# EAGLE design forest21 (EAGLE 7.5.0)
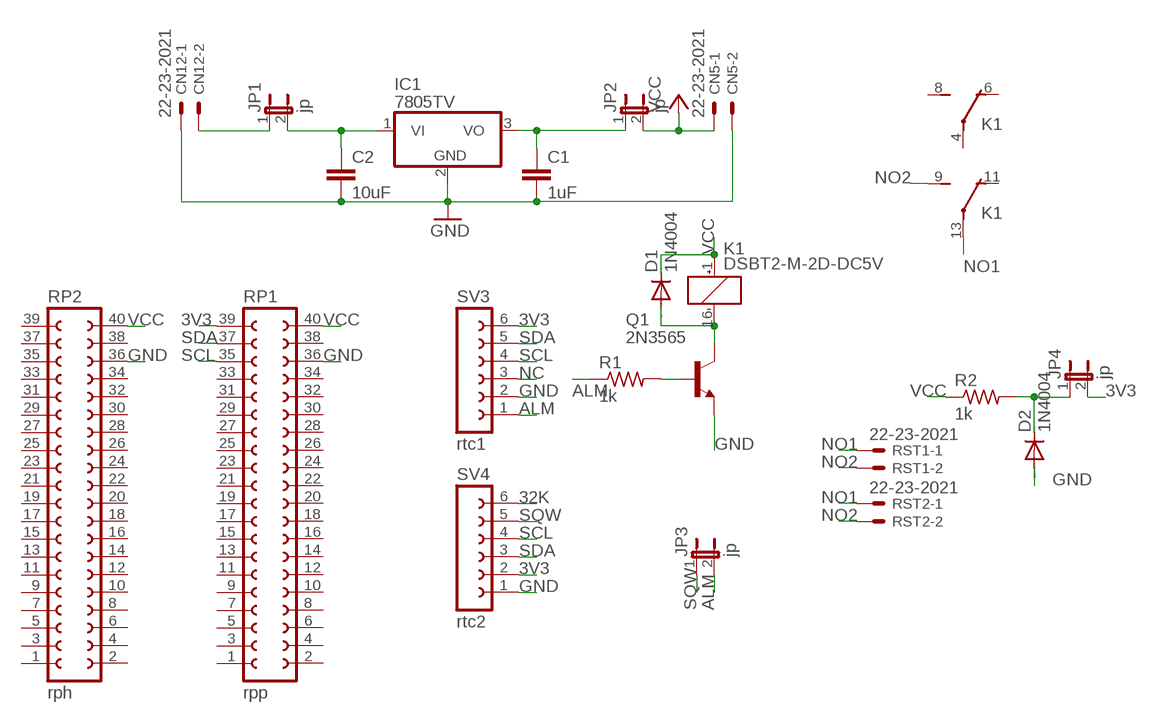
[diagram p0: schematic, sheet 1]

## Parts
C1  1uF  C-EU025-030X050  [C025-030X050]
C2  10uF  C-EU025-030X050  [C025-030X050]
CN5  22-23-2021  [22-23-2021]
CN12  22-23-2021  [22-23-2021]
D1  1N4004  [DO41-10]
D2  1N4004  [DO41-10]
IC1  7805TV  [TO220V]
JP1  jp  JP1E  [JP1]
JP2  jp  JP1E  [JP1]
JP3  jp  JP1E  [JP1]
JP4  jp  JP1E  [JP1]
K1  DSBT2-M-2D-DC5V  [DS-BT]
Q1  2N3565  [TO92]
R1  1k  R-US_0207/7  [0207/7]
R2  1k  R-US_0207/7  [0207/7]
RP1  rpp  FE20-2  [FE20-2]
RP2  rph  FE20-2  [FE20-2]
RST1  22-23-2021  [22-23-2021]
RST2  22-23-2021  [22-23-2021]
SV3  rtc1  FE06-1  [FE06]
SV4  rtc2  FE06-1  [FE06]

## Nets
3V3: JP4.2 RP1.39 SV3.6 SV4.2
32K: SV4.6
ALM: JP3.2 R1.1 SV3.1
GND: C1.2 C2.2 CN5.2 CN12.1 D2.A IC1.2(GND) Q1.3(E) RP1.36 RP2.36 SV3.2 SV4.1
N$1: CN12.2 JP1.1
N$2: C2.1 IC1.1(VI) JP1.2
N$4: C1.1 IC1.3(VO) JP2.1
N$19: Q1.2(B) R1.2
N$20: D1.A K1.16(1:-) Q1.1(C)
N$25: D2.C JP4.1 R2.2
NC: SV3.3
NO1: K1.13(3:P) RST1.1 RST2.1
NO2: K1.9(3:S) RST1.2 RST2.2
SCL: RP1.35 SV3.4 SV4.4
SDA: RP1.37 SV3.5 SV4.3
SQW: JP3.1 SV4.5
VCC: CN5.1 D1.C JP2.2 K1.1(1:+) R2.1 RP1.40 RP2.40
Unconnected: K1.4(2:P) K1.6(2:O) K1.8(2:S) K1.11(3:O) RP1.1 RP1.2 RP1.3 RP1.4 RP1.5 RP1.6 RP1.7 RP1.8 RP1.9 RP1.10 RP1.11 RP1.12 RP1.13 RP1.14 RP1.15 RP1.16 RP1.17 RP1.18 RP1.19 RP1.20 RP1.21 RP1.22 RP1.23 RP1.24 RP1.25 RP1.26 RP1.27 RP1.28 RP1.29 RP1.30 RP1.31 RP1.32 RP1.33 RP1.34 RP1.38 RP2.1 RP2.2 RP2.3 RP2.4 RP2.5 RP2.6 RP2.7 RP2.8 RP2.9 RP2.10 RP2.11 RP2.12 RP2.13 RP2.14 RP2.15 RP2.16 RP2.17 RP2.18 RP2.19 RP2.20 RP2.21 RP2.22 RP2.23 RP2.24 RP2.25 RP2.26 RP2.27 RP2.28 RP2.29 RP2.30 RP2.31 RP2.32 RP2.33 RP2.34 RP2.35 RP2.37 RP2.38 RP2.39

## Library data of the parts
C1 C2 = resistor:C-EU: CAPACITOR, European symbol
CN5 CN12 RST1 RST2 = con-molex:22-23-2021: .100" (2.54mm) Center Header - 2 Pin; MF: MOLEX; MPN: 22-23-2021; OC_FARNELL: 1462926; OC_NEWARK: 25C3832
D1 D2 = diode:1N4004: DIODE general purpose rectifier, 1 A
IC1 = linear:78*: Positive VOLTAGE REGULATOR Source: http://cache.national.com/ds/LM/LM78L05.pdf http://www.fairchildsemi.com/ds/LM/LM7805.pdf
JP1-JP4 = jumper:JP1E: JUMPER
K1 = relay:DSBT2-*: DS-BT RELAYS 4,000 V BREAKDOWN VOLTAGE NAiS Source: http://www.mew-europe.com/.. en_ds_61005_0010.pdf; OC_FARNELL: unknown; OC_NEWARK: unknown
Q1 = transistor-npn:2N3565: NPN Transistor
R1 R2 = resistor:R-US_: RESISTOR, American symbol
RP1 RP2 = con-lsta:FE20-2: FEMALE HEADER; OC_FARNELL: unknown; OC_NEWARK: unknown
SV3 SV4 = con-lsta:FE06-1: FEMALE HEADER; OC_FARNELL: unknown; OC_NEWARK: unknown

## Board
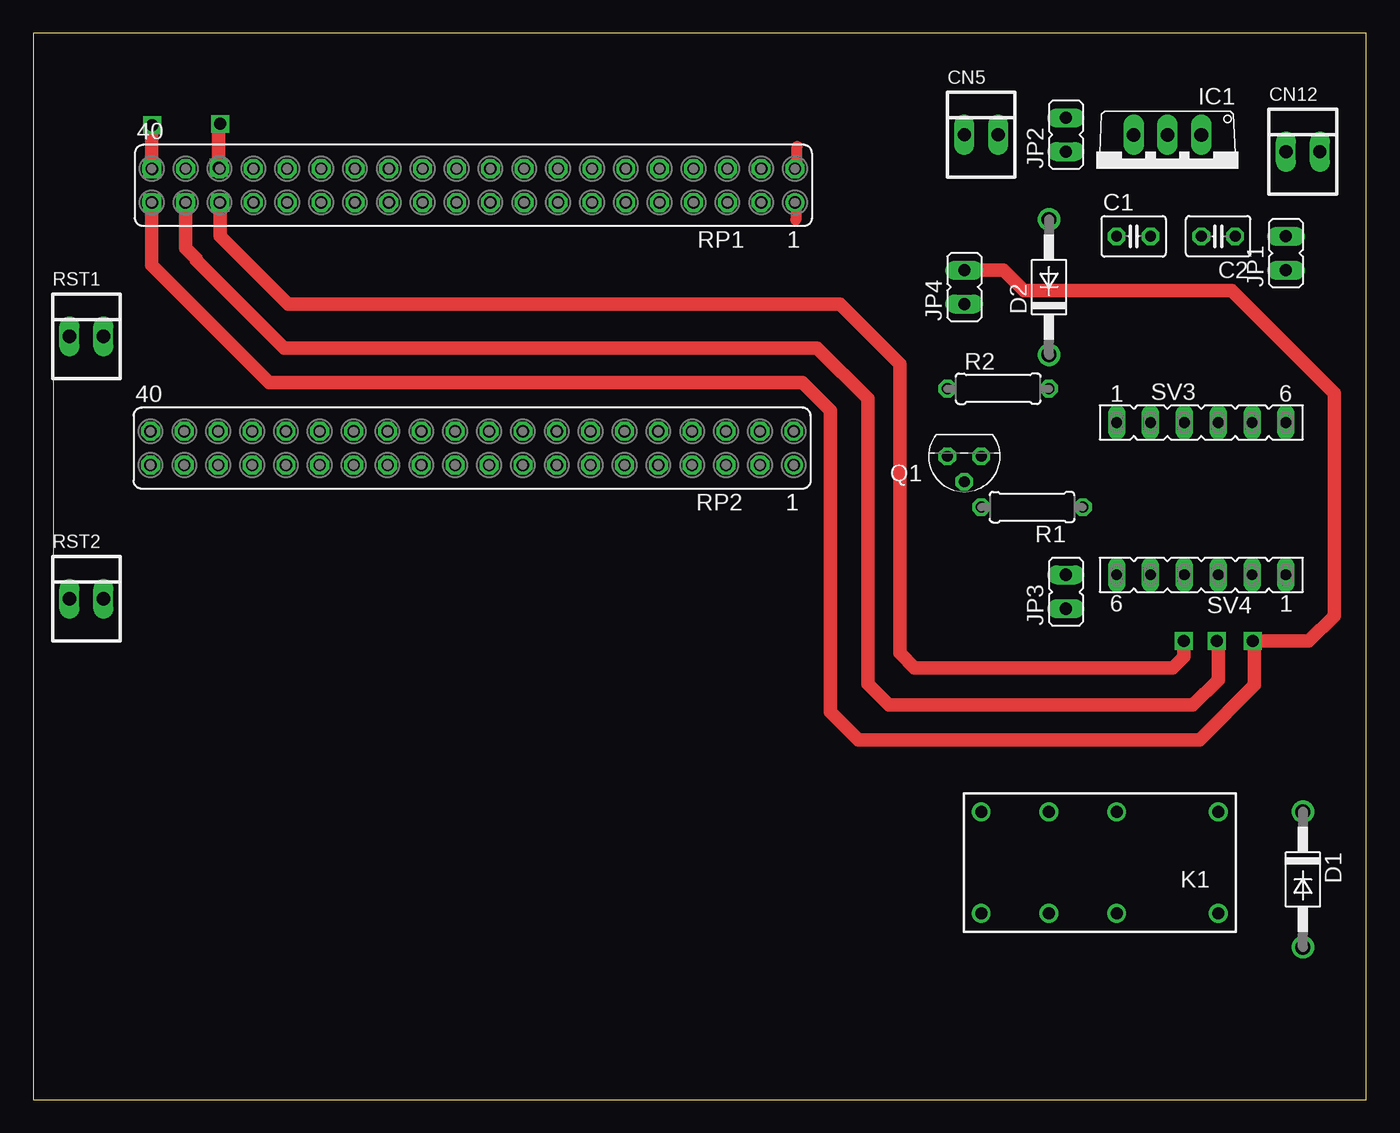
[diagram p1: board, top side]
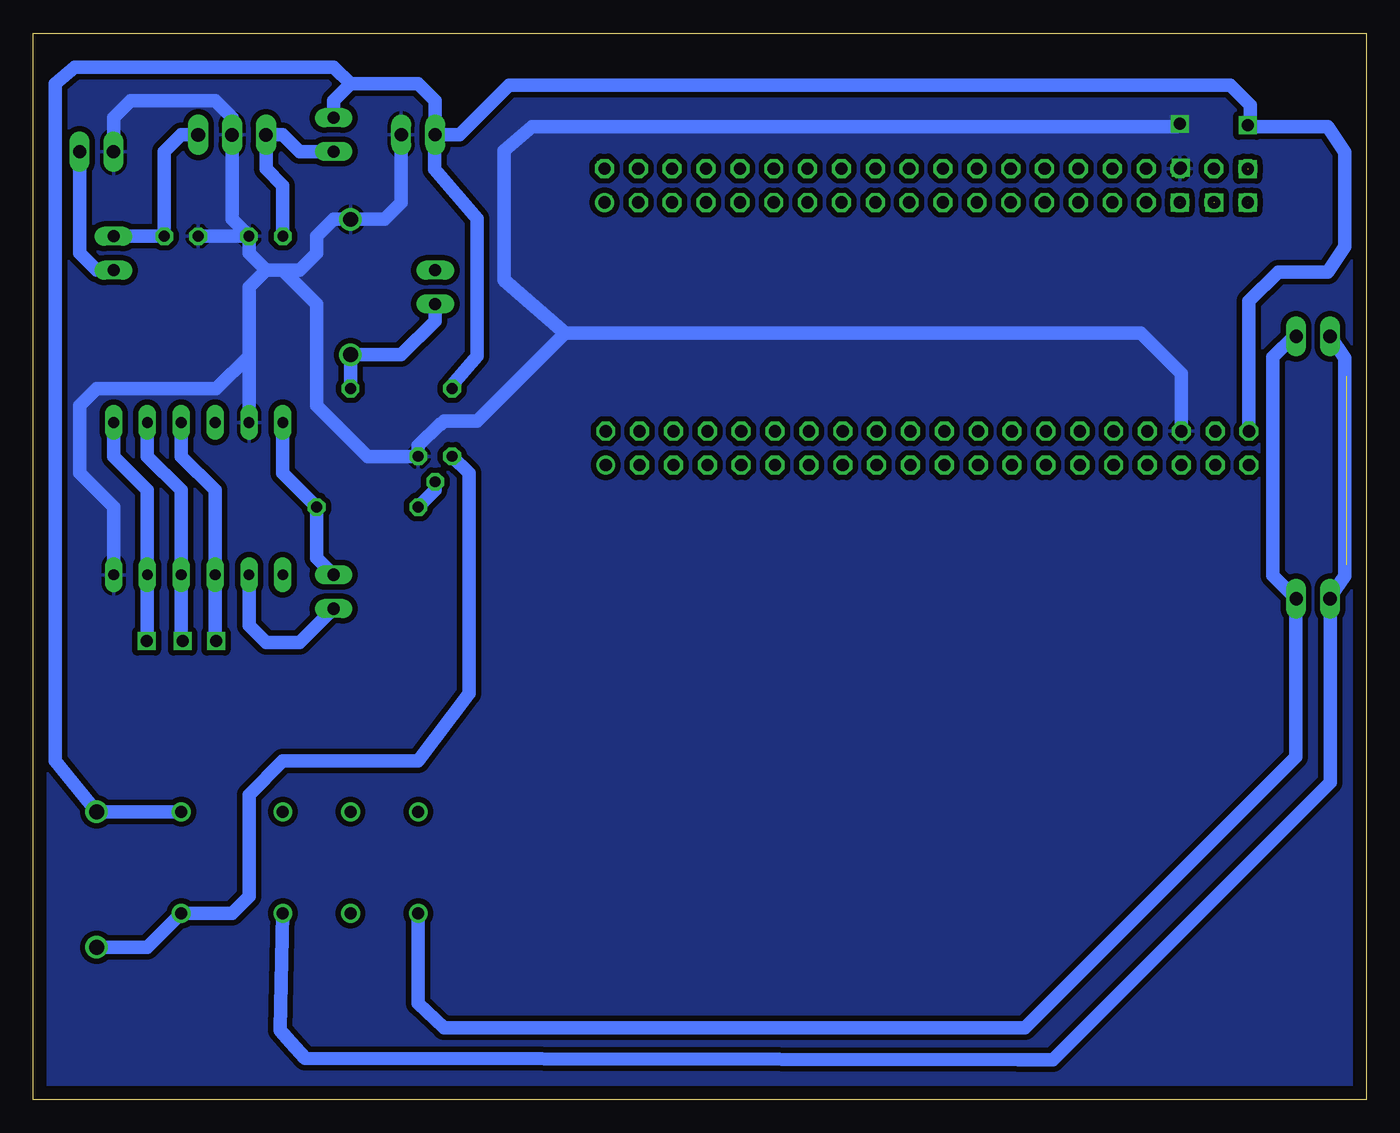
[diagram p2: board, bottom side, seen from below]

Size 100 x 80 mm. Coordinates in mm from the lower left corner, seen from the top.
Outline: 0,0 100,0 100,80 0,80 0,0
Copper layers (1*16): Top 0.035mm / dielectric 1.5mm / Bottom 0.035mm
Design rules "default *": minimum track width 10mil, minimum drill 24mil, track to track 16mil, track to pad 16mil, pad to pad 16mil, via to via 8mil, smd to smd 8mil, copper to edge 40mil, drill to drill 8mil, minimum pad ring 10mil, minimum via ring 8mil, stop-mask expansion 4mil, vias tented up to drill 0mil, thermal gap 10mil

### Footprints (pad centres in the part's own frame; a part is rotated, then mirrored left to right if it is on the bottom)
C025-030X050 = drill 0.813 octagon: 1 -1.27,0; 2 1.27,0
22-23-2021 = drill 1 long: 1 -1.27,0; 2 1.27,0
DO41-10 = drill 1.118: A 5.08,0; C -5.08,0
TO220V = drill 1.016 long: 1 -2.54,-2.54; 2 0,-2.54; 3 2.54,-2.54
JP1 = drill 0.914 long: 1 0,-1.27; 2 0,1.27
DS-BT = drill 0.9: 1 -8.89,-3.81; 4 -1.27,-3.81; 6 3.81,-3.81; 8 8.89,-3.81; 9 8.89,3.81; 11 3.81,3.81; 13 -1.27,3.81; 16 -8.89,3.81
TO92 = drill 0.813 octagon: 1 1.27,0; 2 0,1.905; 3 -1.27,0
0207/7 = drill 0.813 octagon: 1 -3.81,0; 2 3.81,0
FE20-2 = drill 0.914: 1 -24.13,1.27 | drill 0.914 octagon: 2 -24.13,-1.27; 3 -21.59,1.27; 4 -21.59,-1.27; 5 -19.05,1.27; 6 -19.05,-1.27; 7 -16.51,1.27; 8 -16.51,-1.27; 9 -13.97,1.27; 10 -13.97,-1.27; 11 -11.43,1.27; 12 -11.43,-1.27; 13 -8.89,1.27; 14 -8.89,-1.27; 15 -6.35,1.27; 16 -6.35,-1.27; 17 -3.81,1.27; 18 -3.81,-1.27; 19 -1.27,1.27; 20 -1.27,-1.27; 21 1.27,1.27; 22 1.27,-1.27; 23 3.81,1.27; 24 3.81,-1.27; 25 6.35,1.27; 26 6.35,-1.27; 27 8.89,1.27; 28 8.89,-1.27; 29 11.43,1.27; 30 11.43,-1.27; 31 13.97,1.27; 32 13.97,-1.27; 33 16.51,1.27; 34 16.51,-1.27; 35 19.05,1.27; 36 19.05,-1.27; 37 21.59,1.27; 38 21.59,-1.27; 39 24.13,1.27; 40 24.13,-1.27
FE06 = drill 0.813 long: 1 -6.35,0; 2 -3.81,0; 3 -1.27,0; 4 1.27,0; 5 3.81,0; 6 6.35,0

### Placement (x,y rotation side)
C1  82.55,64.77 0 top
C2  88.9,64.77 180 top
CN5  71.12,72.39 0 top
CN12  95.25,71.12 0 top
D1  95.25,16.51 270 top
D2  76.2,60.96 90 top
IC1  85.09,69.85 180 top
JP1  93.98,63.5 0 top
JP2  77.47,72.39 0 top
JP3  77.47,38.1 0 top
JP4  69.85,60.96 0 top
K1  80.01,17.78 180 top
Q1  69.85,48.26 180 top
R1  74.93,44.45 180 top
R2  72.39,53.34 0 top
RP1  33.02,68.58 180 top
RP2  32.92,48.87 180 top
RST1  3.98,57.26 0 top
RST2  3.98,37.57 0 top
SV3  87.63,50.8 0 top
SV4  87.63,39.37 180 top

### Tracks (layer width: path | path; a pad name or v marks a point on that pad's centre or on a via)
3V3  (via drill 0.9)  (1 unrouted)
  Top 1.016: RP1.39 8.89,62.61 17.7,53.8 57.7,53.8 59.8,51.7 59.8,29.1 61.9,27 87.5,27 91.6,31.1 91.6,34.3 v91.5,34.4 95.7,34.4 97.6,36.3 97.6,53 89.9,60.7 74.3,60.7 72.77,62.23 JP4.2
  Bottom 1.016: SV3.6 93.98,48.26 91.44,45.72 SV4.2 91.44,34.46 v91.5,34.4
  other vias: 8.9,67.3
ALM
  Bottom 1.016: JP3.2 78.74,40.64 R1.1 81.28,46.99 SV3.1
GND  (via drill 0.9)
  Top 1.016: v13.9,69.9 13.9,73.1 v14,73.2
  Bottom 1.016: C1.2 85.09,66.04 IC1.2 85.09,73.66 86.36,74.93 92.71,74.93 93.98,73.66 CN12.1 | C2.2 C1.2 | 81.28,62.23 80.01,62.23 78.74,63.5 78.74,64.77 77.47,66.04 D2.A 73.66,66.04 72.39,67.31 CN5.2 | 81.28,62.23 82.55,62.23 | 82.55,62.23 83.82,63.5 C1.2 | SV4.1 93.98,44.45 96.52,46.99 96.52,52.07 95.25,53.34 86.28,53.34 83.82,55.8 | SV3.2 83.82,55.8 | 83.82,55.8 83.82,60.96 82.55,62.23 | 81.28,62.23 78.74,59.69 78.74,52.07 74.93,48.26 Q1.3 71.12,49.08 69.5,50.7 69.4,50.7 69.2,50.9 66.7,50.9 60.1,57.5 | RP2.36 13.87,54.47 16.9,57.5 60.1,57.5 | 60.1,57.5 64.7,61.5 64.7,71.2 62.6,73 14.2,73 v14,73.2
  pour Bottom (isolate 0.305): 0.6,0.5 99.8,0.5 99.8,0.6 99.8,79.8 0.2,79.8 0.2,0.5
N$1
  Bottom 1.016: JP1.1 95.25,62.23 96.52,63.5 CN12.2
N$2
  Bottom 1.016: IC1.1 88.9,72.39 90.17,71.12 C2.1 JP1.2
N$4
  Bottom 1.016: C1.1 81.28,68.58 82.55,69.85 IC1.3 81.28,72.39 80.01,71.12 JP2.1
N$5  (via drill 0.6)
  other vias: 57.2,69.9
N$6  (1 unrouted)
N$7  (via drill 0.6)
  other vias: 57.1,67.3
N$8
  Top 0.813: 57.2,67.4 57.2,66
N$9
  Top 0.813: 57.3,69.8 57.3,71.5
N$19
  Bottom 1.016: Q1.2 69.85,45.72 R1.2
N$20
  Bottom 1.016: D1.A 91.44,11.43 K1.16 85.09,13.97 83.82,15.24 83.82,22.86 81.28,25.4 71.12,25.4 67.31,30.48 67.31,46.99 Q1.1
N$25
  Bottom 1.016: R2.2 D2.C 72.39,55.88 69.85,58.42 JP4.1
NO1
  Bottom 1.016: RST1.1 1.6,55.65 1.6,39.3 2.71,37.69 RST2.1 2.71,23.8 23.51,3 26.1,3 79.6,3.1 80.7,4.3 81.5,5.2 81.48,5.28 K1.13
NO2
  Bottom 1.016: RST1.2 5.44,57.26 7,55.7 7,39.32 RST2.2 5.3,37.52 5.3,25.7 25.6,5.4 69.2,5.4 71.12,7.22 K1.9
SCL  (via drill 0.9)  (1 unrouted)
  Top 1.016: v14,67.3 14,64.8 19.1,59.7 60.5,59.7 65,55.2 65,33.5 66.1,32.4 85.5,32.4 86.3,33.2 v86.3,34.4
  Bottom 1.016: SV3.4 88.9,48.26 86.36,45.72 SV4.4 86.36,34.46 v86.3,34.4
SDA  (via drill 0.9)  (1 unrouted)
  Top 1.016: RP1.37 11.43,63.87 12.2,63.1 12.2,63 18.8,56.4 58.8,56.4 62.6,52.6 62.6,31.2 64.2,29.6 87,29.6 88.9,31.5 88.9,34.3 v88.8,34.4
  Bottom 1.016: SV3.5 91.44,48.26 88.9,45.72 SV4.3 88.9,34.5 v88.8,34.4
  other vias: 11.4,67.3
SQW
  Bottom 1.016: JP3.1 80.01,34.29 82.55,34.29 83.82,35.56 SV4.5
VCC  (via drill 0.9)  (1 unrouted)
  Top 1.016: RP1.40 v8.89,73.09 v8.9,73.1
  Bottom 1.016: JP2.2 77.47,74.93 76.2,76.2 | 76.2,76.2 71.12,76.2 69.85,74.93 CN5.1 | 76.2,76.2 77.47,77.47 96.89,77.47 98.36,76.2 98.36,25.4 D1.C K1.1 | RP2.40 8.79,59.91 6.6,62.1 2.9,62.1 1.6,64 1.6,71.1 2.9,73 8.8,73 v8.9,73.1 8.7,73.3 8.7,74.6 10.2,76.1 64.3,76.1 68.01,72.39 CN5.1 | R2.1 68.58,53.62 66.7,55.8 66.7,66.1 69.9,69.8 69.9,72.34 CN5.1
  other vias: 8.9,69.8